# Altium schematic sheet Header Pinout.SchDoc
size A
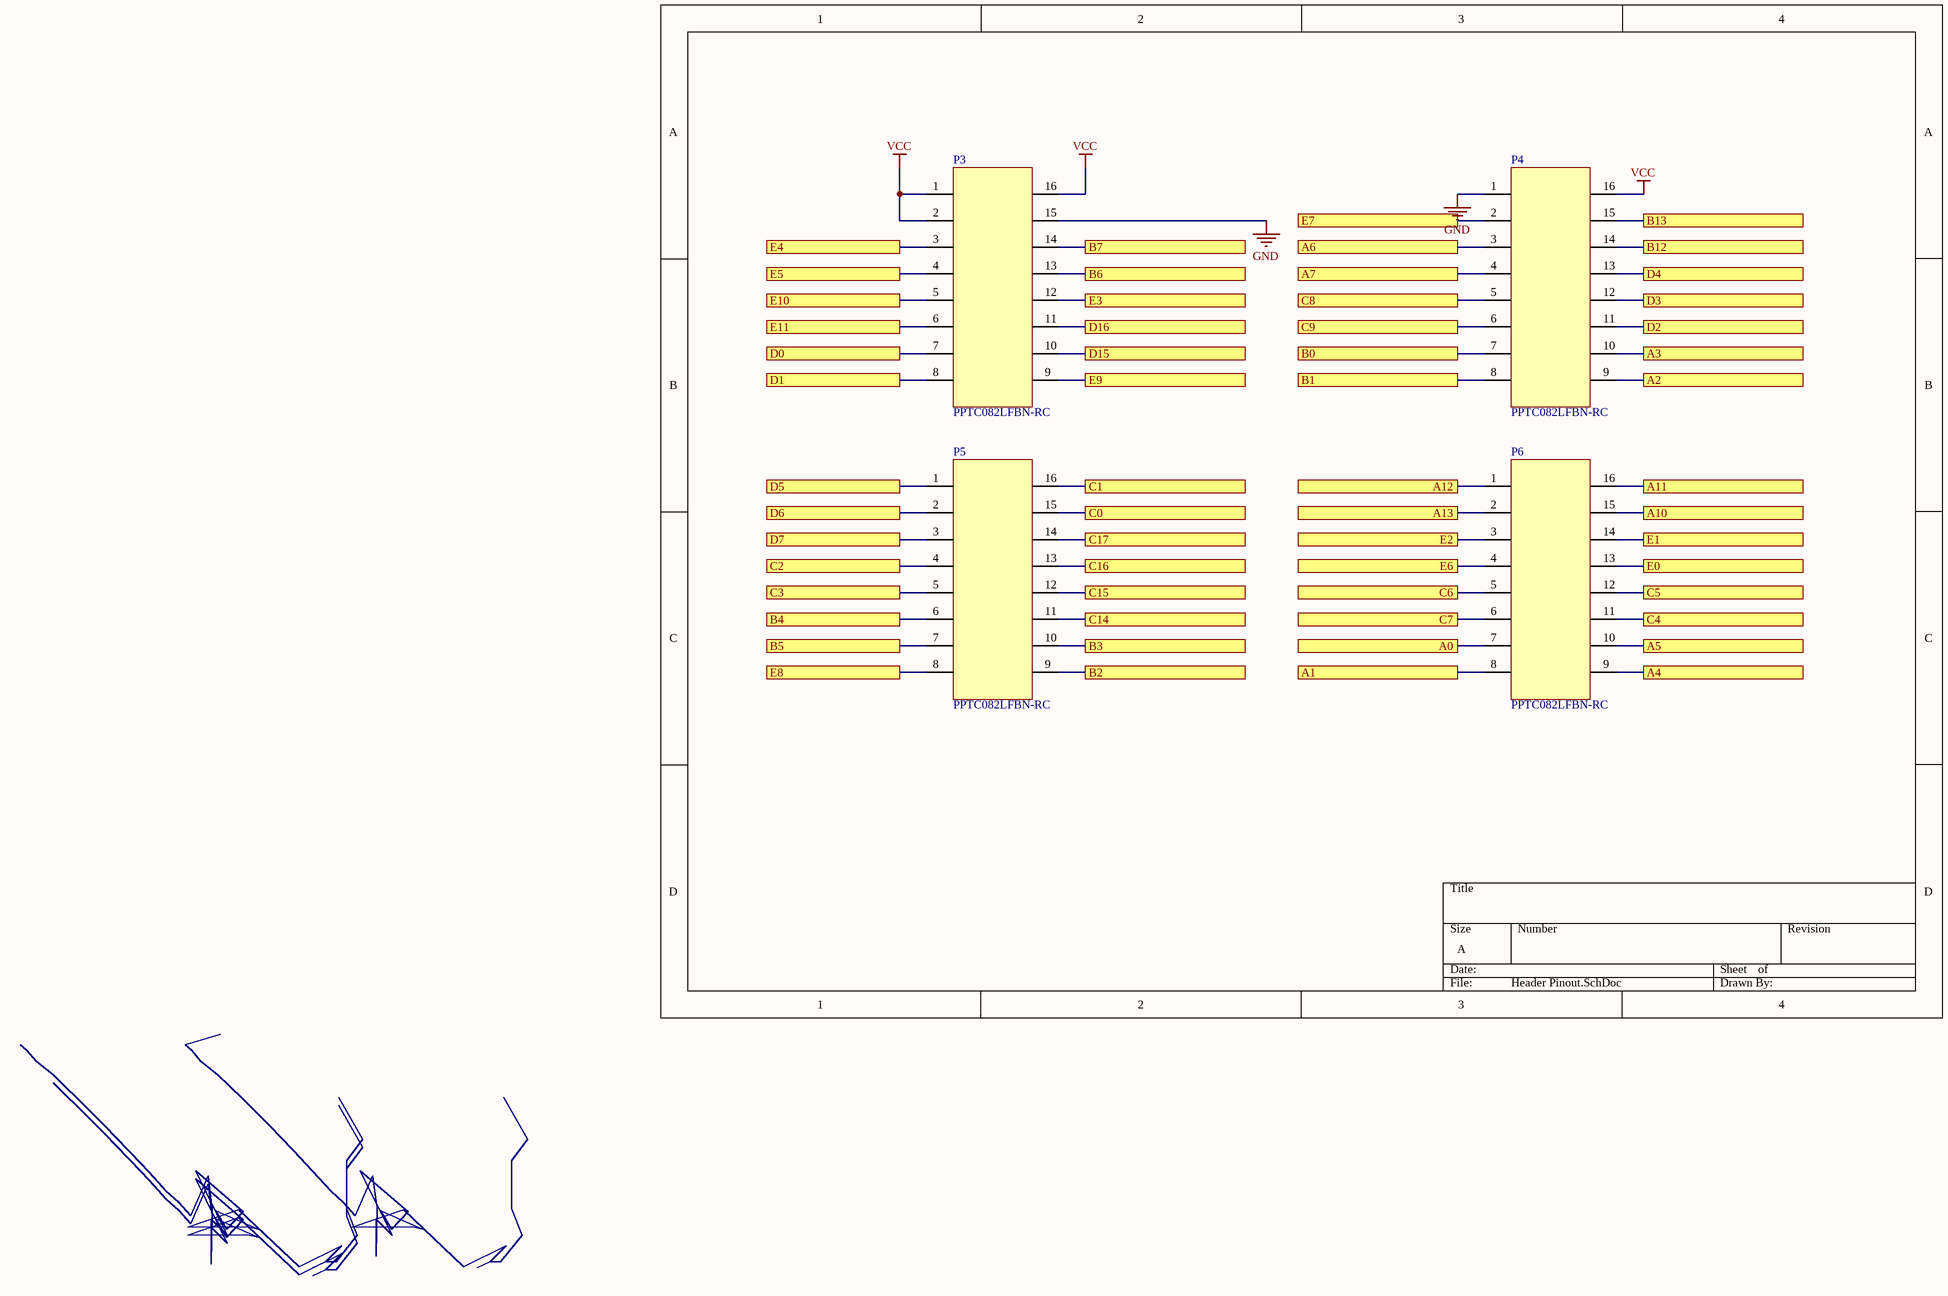
[diagram p0: Header Pinout.SchDoc]

## Parts
P3  PPTC082LFBN-RC  [PPTC082LFBN-RC]
P4  PPTC082LFBN-RC  [PPTC082LFBN-RC]
P5  PPTC082LFBN-RC  [PPTC082LFBN-RC]
P6  PPTC082LFBN-RC  [PPTC082LFBN-RC]

## Ports
A0, A1, A2, A3, A4, A5, A6, A7, A10, A11, A12, A13, B0, B1, B2, B3, B4, B5, B6, B7, B12, B13, C0, C1, C2, C3, C4, C5, C6, C7, C8, C9, C14, C15, C16, C17, D0, D1, D2, D3, D4, D5, D6, D7, D15, D16, E0, E1, E2, E3, E4, E5, E6, E7, E8, E9, E10, E11

## Nets
GND: P3.15 P4.1
VCC: P3.1 P3.2 P3.16 P4.16
A0: P6.7 ; port A0
A1: P6.8 ; port A1
A2: P4.9 ; port A2
A3: P4.10 ; port A3
A4: P6.9 ; port A4
A5: P6.10 ; port A5
A6: P4.3 ; port A6
A7: P4.4 ; port A7
A10: P6.15 ; port A10
A11: P6.16 ; port A11
A12: P6.1 ; port A12
A13: P6.2 ; port A13
B0: P4.7 ; port B0
B1: P4.8 ; port B1
B2: P5.9 ; port B2
B3: P5.10 ; port B3
B4: P5.6 ; port B4
B5: P5.7 ; port B5
B6: P3.13 ; port B6
B7: P3.14 ; port B7
B12: P4.14 ; port B12
B13: P4.15 ; port B13
C0: P5.15 ; port C0
C1: P5.16 ; port C1
C2: P5.4 ; port C2
C3: P5.5 ; port C3
C4: P6.11 ; port C4
C5: P6.12 ; port C5
C6: P6.5 ; port C6
C7: P6.6 ; port C7
C8: P4.5 ; port C8
C9: P4.6 ; port C9
C14: P5.11 ; port C14
C15: P5.12 ; port C15
C16: P5.13 ; port C16
C17: P5.14 ; port C17
D0: P3.7 ; port D0
D1: P3.8 ; port D1
D2: P4.11 ; port D2
D3: P4.12 ; port D3
D4: P4.13 ; port D4
D5: P5.1 ; port D5
D6: P5.2 ; port D6
D7: P5.3 ; port D7
D15: P3.10 ; port D15
D16: P3.11 ; port D16
E0: P6.13 ; port E0
E1: P6.14 ; port E1
E2: P6.3 ; port E2
E3: P3.12 ; port E3
E4: P3.3 ; port E4
E5: P3.4 ; port E5
E6: P6.4 ; port E6
E7: P4.2 ; port E7
E8: P5.8 ; port E8
E9: P3.9 ; port E9
E10: P3.5 ; port E10
E11: P3.6 ; port E11

## Library data of the parts
P3-P6 = 23: 2x8 female header; Manufacturer_id: 1; idConn: 23; Value: CONN; Voltage_Rating: V; Num_Contacts: 16; Num_Rows: 2; Pitch: 2.54; Created_By: Austin; Updated_By: Null; Drawer_id: 1; Name: PPTC082LFBN-RC; Package: Conn; MfrPartNo: PPTC082LFBN-RC; Link: https://www.digikey.com/product-detail/en/sullins-connector-solutions/PPTC082LFBN-RC/S7076-ND/810214; ComponentLink1Description: Null; ComponentLink1URL: Null; Supplier1: Digi-Key; Supplier1PartNo: S7076-ND; Created_Date: 12/15/2018